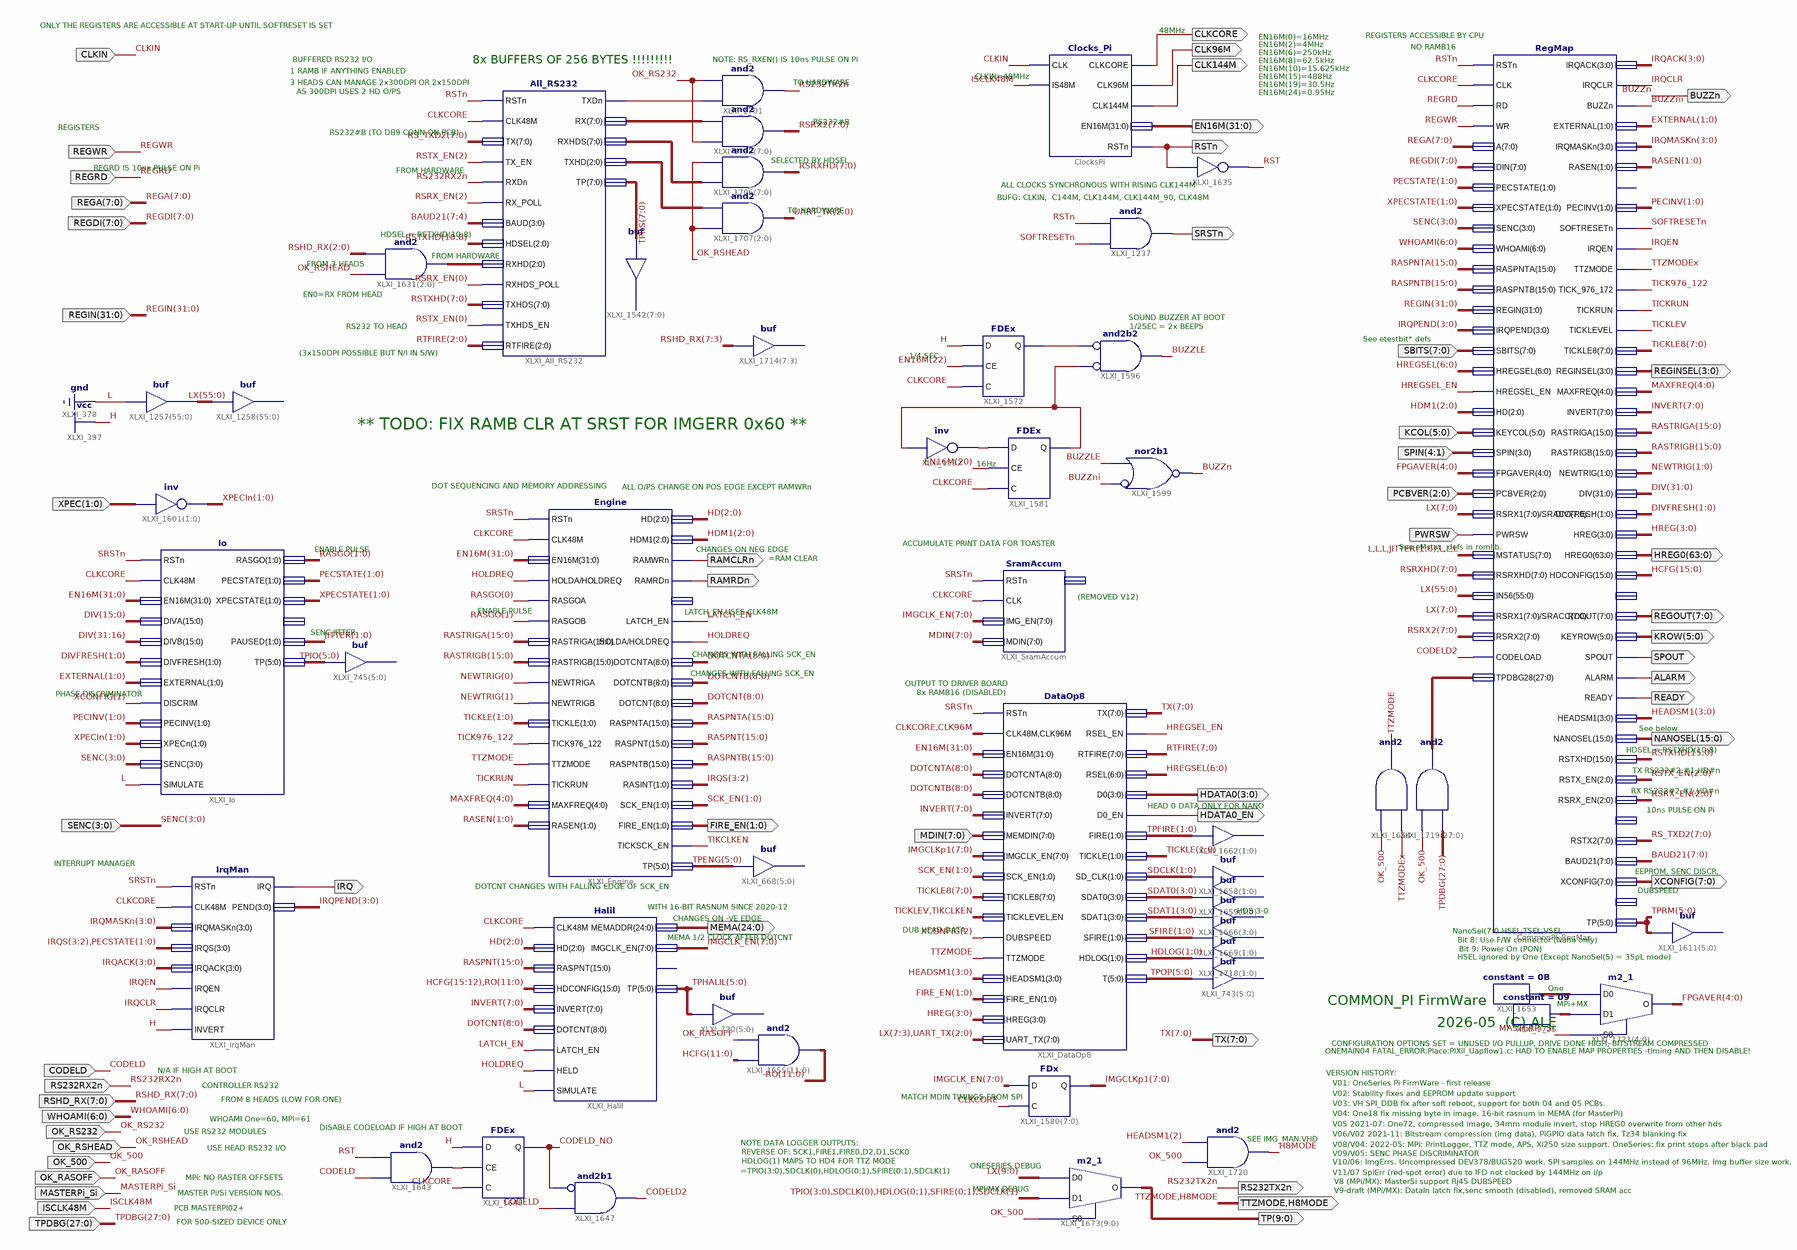
[diagram p0: schematic sheet 1]
// Xilinx ISE schematic Common_Pi.sch (spartan6) as structural Verilog: 49 symbols, 53 ports
module Common_Pi (
  input  [31:0] REGIN,
  input  [6:0] WHOAMI,
  input  [7:0] REGA,
  input  [7:0] REGDI,
  input  REGWR,
  input  REGRD,
  input  CLKIN,
  input  CODELD,
  input  [7:0] SBITS,
  input  [2:0] PCBVER,
  input  [5:0] KCOL,
  input  PWRSW,
  input  [4:1] SPIN,
  input  [3:0] SENC,
  input  [1:0] XPEC,
  input  OK_RS232,
  input  RS232RX2n,
  input  OK_500,
  input  OK_RASOFF,
  input  MASTERPi_Si,
  input  ISCLK48M,
  input  OK_RSHEAD,
  input  [7:0] MDIN,
  input  [7:0] RSHD_RX,
  input  [27:0] TPDBG,
  output CLKCORE,
  output RSTn,
  output TTZMODE,
  output SRSTn,
  output BUZZn,
  output [31:0] EN16M,
  output [1:0] FIRE_EN,
  output [3:0] REGINSEL,
  output [63:0] HREG0,
  output [5:0] KROW,
  output ALARM,
  output READY,
  output [15:0] NANOSEL,
  output SPOUT,
  output [7:0] REGOUT,
  output CLK96M,
  output [7:0] XCONFIG,
  output CLK144M,
  output [24:0] MEMA,
  output IRQ,
  output RS232TX2n,
  output [9:0] TP,
  output RAMRDn,
  output RAMCLRn,
  output [7:0] TX,
  output [3:0] HDATA0,
  output HDATA0_EN,
  output H8MODE
);

  wire BUZZLE, BUZZni, CODELD2, CODELD_NO, HOLDREQ, HREGSEL_EN, IRQCLR, IRQEN, LATCH_EN, RST, SOFTRESETn,
       TICK976_122, TICKLEV, TICKRUN, TIKCLKEN, TTZMODEx, XLXN_1749, XLXN_1760, XLXN_1798, XLXN_1878,
       XLXN_1984;
  wire [1:0] DIVFRESH, EXTERNAL, HDLOG, JITTER, NEWTRIG, PECINV, PECSTATE, RASEN, RASGO, SCK_EN, SDCLK,
       SFIRE, TICKLE, TPFIRE, XPECIn, XPECSTATE;
  wire [2:0] HD, HDM1, RSRX_EN, RSTX_EN, UART_TX, XLXN_1971, XLXN_2009;
  wire [3:0] HEADSM1, HREG, IRQACK, IRQMASKn, IRQPEND, SDAT0, SDAT1;
  wire [3:2] IRQS;
  wire [4:0] FPGAVER, MAXFREQ, XLXN_2015, XLXN_2016;
  wire [5:0] TPENG, TPHALIL, TPIO, TPOP, TPRM;
  wire [6:0] HREGSEL;
  wire [7:0] BAUD21, IMGCLK_EN, IMGCLKp1, INVERT, RS_TXD2, RSRX2, RSRXHD, RTFIRE, TICKLE8, TPRS, XLXN_1994,
       XLXN_2008;
  wire [8:0] DOTCNT, DOTCNTA, DOTCNTB;
  wire [11:0] RO;
  wire [15:0] HCFG, RASPNT, RASPNTA, RASPNTB, RASTRIGA, RASTRIGB, RSTXHD;
  wire [27:0] XLXN_2012;
  wire [31:0] DIV;
  wire [55:0] LX;

  assign XPECIn = ~XPEC;  // inv XLXI_1601[1..0], 2 bits wide
  and XLXI_1237 (SRSTn, SOFTRESETn, RSTn);
  Clocks_Pi ClocksPi (
    .CLK(CLKIN), .CLK144M(CLK144M), .CLK96M(CLK96M), .CLKCORE(CLKCORE), .EN16M(EN16M), .IS48M(ISCLK48M),
    .RSTn(RSTn));
  FDEx XLXI_1572 (.C(CLKCORE), .CE(EN16M[22]), .D(1'b1), .Q(XLXN_1749));
  and XLXI_1596 (BUZZLE, ~XLXN_1798, ~XLXN_1749);  // and2b2
  not XLXI_1582 (XLXN_1760, XLXN_1798);
  FDEx XLXI_1581 (.C(CLKCORE), .CE(EN16M[20]), .D(XLXN_1760), .Q(XLXN_1798));
  nor XLXI_1599 (BUZZn, ~BUZZni, BUZZLE);  // nor2b1
  // buf XLXI_720[5..0] has open pins: I=TPHALIL, O=open
  not XLXI_1635 (RST, RSTn);
  and XLXI_1654 (TTZMODE, TTZMODEx, OK_500);
  assign RO = HCFG[11:0] & {12{OK_RASOFF}};  // and2 XLXI_1655[11..0], 12 bits wide
  Halil XLXI_Halil (
    .CLK48M(CLKCORE), .DOTCNT(DOTCNT), .HD(HD), .HDCONFIG({HCFG[15:12], RO}), .HELD(HOLDREQ),
    .IMGCLK_EN(IMGCLK_EN), .INVERT(INVERT), .LATCH_EN(LATCH_EN), .MEMADDR(MEMA), .RASPNT(RASPNT),
    .SIMULATE(1'b0), .TP(TPHALIL));  // open: IMGCLRn
  IrqMan XLXI_IrqMan (
    .CLK48M(CLKCORE), .IRQ(IRQ), .IRQACK(IRQACK), .IRQCLR(IRQCLR), .IRQEN(IRQEN), .IRQMASKn(IRQMASKn),
    .IRQS({IRQS, PECSTATE}), .PEND(IRQPEND), .RSTn(SRSTn), .INVERT(1'b1));
  and XLXI_1647 (CODELD2, ~CODELD_NO, CODELD);  // and2b1
  and XLXI_1643 (XLXN_1878, CODELD, RST);
  FDEx XLXI_1646 (.C(CLKCORE), .CE(XLXN_1878), .D(1'b1), .Q(CODELD_NO));
  Engine XLXI_Engine (
    .CLK48M(CLKCORE), .DOTCNT(DOTCNT), .DOTCNTA(DOTCNTA), .DOTCNTB(DOTCNTB), .EN16M(EN16M),
    .FIRE_EN(FIRE_EN), .HD(HD), .HDM1(HDM1), .HOLDA(HOLDREQ), .HOLDREQ(HOLDREQ), .LATCH_EN(LATCH_EN),
    .MAXFREQ(MAXFREQ), .NEWTRIGA(NEWTRIG[0]), .NEWTRIGB(NEWTRIG[1]), .RAMWRn(RAMCLRn), .RAMRDn(RAMRDn),
    .RASEN(RASEN), .RASGOA(RASGO[0]), .RASGOB(RASGO[1]), .RASINT(IRQS), .RASPNT(RASPNT), .RASPNTA(RASPNTA),
    .RASPNTB(RASPNTB), .RASTRIGA(RASTRIGA), .RASTRIGB(RASTRIGB), .RSTn(SRSTn), .SCK_EN(SCK_EN),
    .TICK976_122(TICK976_122), .TICKLE(TICKLE), .TICKRUN(TICKRUN), .TICKSCK_EN(TIKCLKEN), .TP(TPENG),
    .TTZMODE(TTZMODE));  // open: RASGO_EN
  // buf XLXI_668[5..0] has open pins: I=TPENG, O=open
  All_RS232 XLXI_All_RS232 (
    .BAUD(BAUD21[7:4]), .CLK48M(CLKCORE), .HDSEL(RSTXHD[10:8]), .RSTn(RSTn), .RTFIRE(RTFIRE[2:0]),
    .RX(XLXN_1994), .RXDn(RS232RX2n), .RXHD(XLXN_1971), .RXHDS(XLXN_2008), .RXHDS_POLL(RSRX_EN[0]),
    .RX_POLL(RSRX_EN[2]), .TP(TPRS), .TX(RS_TXD2), .TXDn(XLXN_1984), .TXHD(XLXN_2009), .TXHDS(RSTXHD[7:0]),
    .TXHDS_EN(RSTX_EN[0]), .TX_EN(RSTX_EN[2]));
  assign LX = {56{1'b0}};  // buf XLXI_1257[55..0], 56 bits wide
  // buf XLXI_1258[55..0] has open pins: I=LX, O=open
  // buf XLXI_1542[7..0] has open pins: I=TPRS, O=open
  assign XLXN_1971 = {3{OK_RSHEAD}} & RSHD_RX[2:0];  // and2 XLXI_1631[2..0], 3 bits wide
  assign UART_TX = {3{OK_RSHEAD}} & XLXN_2009;  // and2 XLXI_1707[2..0], 3 bits wide
  assign RSRX2 = {8{OK_RS232}} & XLXN_1994;  // and2 XLXI_1702[7..0], 8 bits wide
  and XLXI_1701 (RS232TX2n, XLXN_1984, OK_RS232);
  assign RSRXHD = XLXN_2008 & {8{OK_RSHEAD}};  // and2 XLXI_1706[7..0], 8 bits wide
  // buf XLXI_1714[7..3] has open pins: I=RSHD_RX[7:3], O=open
  SramAccum XLXI_SramAccum (.CLK(CLKCORE), .IMG_EN(IMGCLK_EN), .MDIN(MDIN), .RSTn(SRSTn));  // open: Q
  // buf XLXI_1662[1..0] has open pins: I=TPFIRE, O=open
  FDx XLXI_1580[7:0] (.C(CLKCORE), .D(IMGCLK_EN), .Q(IMGCLKp1));
  // buf XLXI_1658[1..0] has open pins: I=SDCLK, O=open
  // buf XLXI_1659[3..0] has open pins: I=SDAT0, O=open
  // buf XLXI_1666[3..0] has open pins: I=SDAT1, O=open
  // buf XLXI_1669[1..0] has open pins: I=SFIRE, O=open
  DataOp8 XLXI_DataOp8 (
    .CLK48M(CLKCORE), .CLK96M(CLK96M), .D0(HDATA0), .D0_EN(HDATA0_EN), .DOTCNTA(DOTCNTA), .DOTCNTB(DOTCNTB),
    .EN16M(EN16M), .FIRE(TPFIRE), .FIRE_EN(FIRE_EN), .HDLOG(HDLOG), .HEADSM1(HEADSM1), .HREG(HREG),
    .IMGCLK_EN(IMGCLKp1), .INVERT(INVERT), .MEMDIN(MDIN), .RSEL(HREGSEL), .RSEL_EN(HREGSEL_EN), .RSTn(SRSTn),
    .RTFIRE(RTFIRE), .SCK_EN(SCK_EN), .SDAT0(SDAT0), .SDAT1(SDAT1), .SD_CLK(SDCLK), .SFIRE(SFIRE), .T(TPOP),
    .TICKLE(TICKLE), .TICKLE8(TICKLE8), .TICKLEVEL(TICKLEV), .EN(TIKCLKEN), .DUBSPEED(XCONFIG[2]),
    .TTZMODE(TTZMODE), .TX(TX), .UART_TX({LX[7:3], UART_TX}));
  // buf XLXI_743[5..0] has open pins: I=TPOP, O=open
  // buf XLXI_1718[1..0] has open pins: I=HDLOG, O=open
  // buf XLXI_745[5..0] has open pins: I=TPIO, O=open
  Io XLXI_Io (
    .CLK48M(CLKCORE), .DISCRIM(XCONFIG[1]), .DIVA(DIV[15:0]), .DIVB(DIV[31:16]), .DIVFRESH(DIVFRESH),
    .EN16M(EN16M), .EXTERNAL(EXTERNAL), .PAUSED(JITTER), .PECINV(PECINV), .PECSTATE(PECSTATE), .RASGO(RASGO),
    .RSTn(SRSTn), .SENC(SENC), .SIMULATE(1'b0), .TP(TPIO), .XPECn(XPECIn), .XPECSTATE(XPECSTATE));  // open: DIR
  assign XLXN_2012 = TPDBG & {28{OK_500}};  // and2 XLXI_1719[27..0], 28 bits wide
  RegMap CommonPi_RegMap (
    .A(REGA), .ALARM(ALARM), .BAUD21(BAUD21), .BUZZn(BUZZni), .CLK(CLKCORE), .CODELOAD(CODELD2), .DIN(REGDI),
    .DIV(DIV), .DIVFRESH(DIVFRESH), .EXTERNAL(EXTERNAL), .FPGAVER(FPGAVER), .HD(HDM1), .HDCONFIG(HCFG),
    .HEADSM1(HEADSM1), .HREG(HREG), .HREG0(HREG0), .HREGSEL(HREGSEL), .HREGSEL_EN(HREGSEL_EN), .IN56(LX),
    .INVERT(INVERT), .IRQACK(IRQACK), .IRQCLR(IRQCLR), .IRQEN(IRQEN), .IRQMASKn(IRQMASKn), .IRQPEND(IRQPEND),
    .KEYCOL(KCOL), .KEYROW(KROW), .MAXFREQ(MAXFREQ), .MSTATUS({3'b000, JITTER, 3'b000}), .NANOSEL(NANOSEL),
    .NEWTRIG(NEWTRIG), .PCBVER(PCBVER), .PECINV(PECINV), .PECSTATE(PECSTATE), .PWRSW(PWRSW), .RASEN(RASEN),
    .RASPNTA(RASPNTA), .RASPNTB(RASPNTB), .RASTRIGA(RASTRIGA), .RASTRIGB(RASTRIGB), .RD(REGRD),
    .RDOUT(REGOUT), .READY(READY), .REGIN(REGIN), .REGINSEL(REGINSEL), .RSRX1(LX[7:0]), .RSRX2(RSRX2),
    .RSRXHD(RSRXHD), .RSRX_EN(RSRX_EN), .RSTn(RSTn), .RSTX2(RS_TXD2), .RSTXHD(RSTXHD), .RSTX_EN(RSTX_EN),
    .SBITS(SBITS), .SENC(SENC), .SOFTRESETn(SOFTRESETn), .SPIN(SPIN), .SPOUT(SPOUT), .SRACC(LX[7:0]),
    .TICKLE8(TICKLE8), .TICKLEVEL(TICKLEV), .TICKRUN(TICKRUN), .TICK_976_172(TICK976_122), .TP(TPRM),
    .TPDBG28(XLXN_2012), .TTZMODE(TTZMODEx), .WHOAMI(WHOAMI), .WR(REGWR), .XCONFIG(XCONFIG),
    .XPECSTATE(XPECSTATE));  // open: HCONF16X8, HOLDEN, IN56_EN, RSTX1
  // buf XLXI_1611[5..0] has open pins: I=TPRM, O=open
  and XLXI_1720 (H8MODE, OK_500, HEADSM1[2]);
  m2_1 XLXI_1673[9:0] (
    .D0(LX[9:0]), .D1({TPIO[3:0], SDCLK[0], HDLOG[0], HDLOG[1], SFIRE[0], SFIRE[1], SDCLK[1]}), .S0(OK_500),
    .O(TP));
  constant #(.CValue("0B")) XLXI_1653 (.O(XLXN_2015));
  m2_1 XLXI_1721[4:0] (.D0(XLXN_2015), .D1(XLXN_2016), .S0(MASTERPi_Si), .O(FPGAVER));
  constant #(.CValue("09")) XLXI_1725 (.O(XLXN_2016));

  // Notes on the sheet:
  //   ONLY THE REGISTERS ARE ACCESSIBLE AT START-UP UNTIL SOFTRESET IS SET
  //   48MHz
  //   REGISTERS ACCESSIBLE BY CPU
  //   EN16M(0)=16MHz
  //   EN16M(2)=4MHz
  //   NO RAMB16
  //   EN16M(6)=250kHz
  //   BUFFERED RS232 I/O
  //   8x BUFFERS OF 256 BYTES !!!!!!!!!
  //   NOTE: RS_RXEN() IS 10ns PULSE ON Pi
  //   EN16M(8)=62.5kHz
  //   EN16M(10)=15.625kHz
  //   1 RAMB IF ANYTHING ENABLED
  //   CLKIN=48MHz
  //   EN16M(15)=488Hz
  //   3 HEADS CAN MANAGE 2x300DPI OR 2x150DPI
  //   TO HARDWARE
  //   EN16M(19)=30.5Hz
  //   AS 300DPI USES 2 HD O/PS
  //   EN16M(24)=0.95Hz
  //   RS232#B
  //   REGISTERS
  //   RS232#B (TO DB9 CONN ON PCB)
  //   SELECTED BY HDSEL
  //   REGRD IS 10ns PULSE ON Pi
  //   FROM HARDWARE
  //   ALL CLOCKS SYNCHRONOUS WITH RISING CLK144M
  //   BUFG: CLKIN,  C144M, CLK144M, CLK144M_90, CLK48M
  //   TO HARDWARE
  //   HDSEL = RSTXHD(10:8)
  //   FROM HARDWARE
  //   FROM 3 HEADS
  //   EN0=RX FROM HEAD
  //   SOUND BUZZER AT BOOT
  //   RS232 TO HEAD
  //   1/2SEC = 2x BEEPS
  //   See etestbit* defs
  //   (3x150DPI POSSIBLE BUT N/I IN S/W)
  //   1/4 SEC
  //   ** TODO: FIX RAMB CLR AT SRST FOR IMGERR 0x60 **
  //   16Hz
  //   DOT SEQUENCING AND MEMORY ADDRESSING
  //   ALL O/PS CHANGE ON POS EDGE EXCEPT RAMWRn
  //   ACCUMULATE PRINT DATA FOR TOASTER
  //   See eMstat_ defs in romlib.
  //   ENABLE PULSE
  //   CHANGES ON NEG EDGE
  //   =RAM CLEAR
  //   (REMOVED V12)
  //   ENABLE PULSE
  //   LATCH_EN USES CLK48M
  //   SENC JITTER
  //   CHANGES WITH FALLING SCK_EN
  //   CHANGES WITH FALLING SCK_EN
  //   OUTPUT TO DRIVER BOARD
  //   8x RAMB16 (DISABLED)
  //   PHASE DISCRIMINATOR
  //   See below
  //   HDSEL = RSTXHD(10:8)
  //   TX RS232#2,#1,HD#n
  //   RX RS232#2,#1,HD#n
  //   HEAD 0 DATA ONLY FOR NANO
  //   10ns PULSE ON Pi
  //   INTERRUPT MANAGER
  //   EEPROM, SENC DISCR,
  //   DOTCNT CHANGES WITH FALLING EDGE OF SCK_EN
  //   DUBSPEED
  //   WITH 16-BIT RASNUM SINCE 2020-12
  //   HDS 3-0
  //   CHANGES ON -VE EDGE
  //   DUB HEAD DATA
  //   NanoSel(7:0 HSEL,TSEL,VSEL
  //   MEMA 1/2 CLOCK AFTER DOTCNT
  //   Bit 8: Use F/W connector (Nano only)
  //   Bit 9: Power On (PON)
  //   HSEL ignored by One (Except NanoSel(5) = 35pL mode)
  //   One
  //   COMMON_PI FirmWare
  //   MPi+MX
  //   2026-05  (C) ALE
  //   CONFIGURATION OPTIONS SET = UNUSED I/O PULLUP, DRIVE DONE HIGH, BITSTREAM COMPRESSED
  //   ONEMAIN04 FATAL_ERROR:Place:PlXil_Uapflow1.c: HAD TO ENABLE MAP PROPERTIES -timing AND THEN DISABLE!
  //   N/A IF HIGH AT BOOT
  //   VERSION HISTORY:
  //   V01: OneSeries Pi FirmWare - first release
  //   CONTROLLER RS232
  //   V02: Stability fixes and EEPROM update support
  //   MATCH MDIN TIMINGS FROM SPI
  //   FROM 8 HEADS (LOW FOR ONE)
  //   V03: VH SPI_DDB fix after soft reboot, support for both 04 and 05 PCBs.
  //   V04: One18 fix missing byte in image. 16-bit rasnum in MEMA (for MasterPi)
  //   WHOAMI One=60, MPi=61
  //   V05 2021-07: One72, compressed image, 34mm module invert, stop HREG0 overwrite from other hds
  //   DISABLE CODELOAD IF HIGH AT BOOT
  //   USE RS232 MODULES
  //   V06/V02 2021-11: Bitstream compression (img data), PiGPIO data latch fix, Tz34 blanking fix
  //   SEE IMG_MAN.VHD
  //   NOTE DATA LOGGER OUTPUTS:
  //   V08/V04: 2022-05: MPi: PrintLogger, TTZ mode, APS, Xi250 size support. OneSeries: fix print stops after black pad
  //   USE HEAD RS232 I/O
  //   REVERSE OF: SCK1,FIRE1,FIRE0,D2,D1,SCK0
  //   V09/V05: SENC PHASE DISCRIMINATOR
  //   HDLOG(1) MAPS TO HD4 FOR TTZ MODE
  //   V10/06: ImgErrs. Uncompressed DEV378/BUG520 work. SPI samples on 144MHz instead of 96MHz. Img buffer size work.
  //   ONESERIES DEBUG
  //   =TPIO(3:0),SDCLK(0),HDLOG(0:1),SFIRE(0:1),SDCLK(1)
  //   V11/07 SpiErr (red-spot error) due to IFD not clocked by 144MHz on i/p
  //   MPi: NO RASTER OFFSETS
  //   V8 (MPi/MX): MasterSi support Rj45 DUBSPEED
  //   MPI/MX DEBUG
  //   V9-draft (MPi/MX): DataIn latch fix,senc smooth (disabled), removed SRAM acc
  //   MASTER Pi/Si VERSION NOS.
  //   PCB MASTERPI02+
  //   FOR 500-SIZED DEVICE ONLY
endmodule
